# EAGLE schematic board (EAGLE 9.6.2)
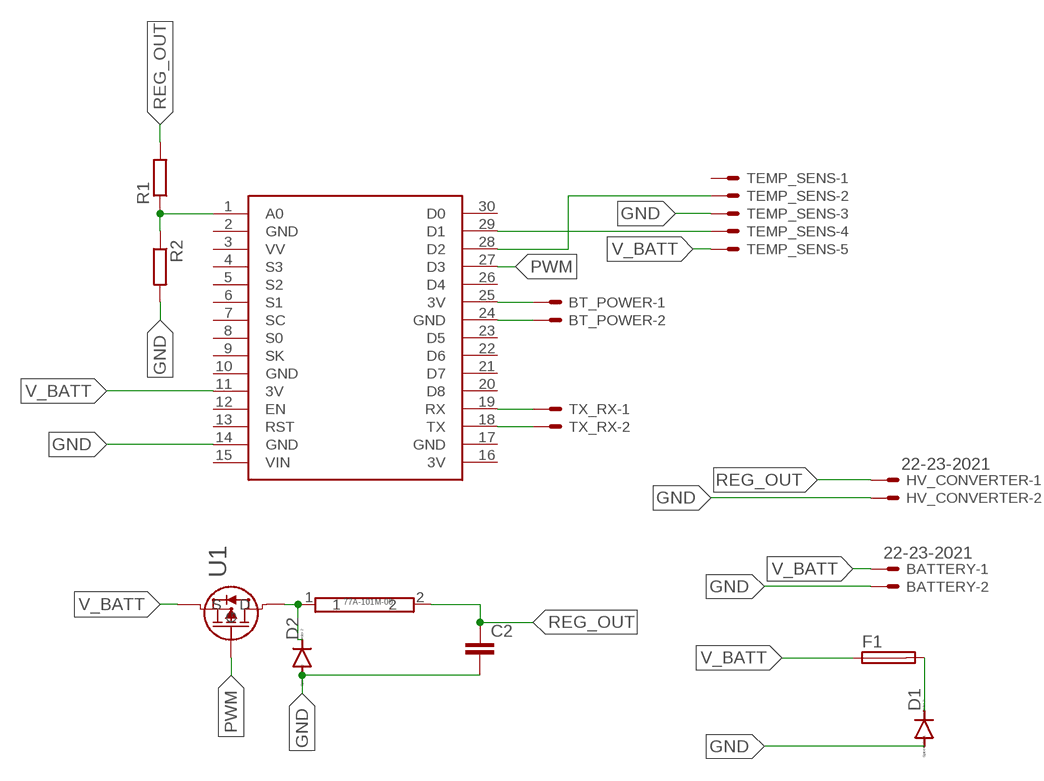
[diagram p0: schematic, sheet 1]

## Parts
BATTERY  22-23-2021  [22-23-2021]
BT_POWER  22-23-2021  [22-23-2021]
C2  C-EU025-024X044  [C025-024X044]
D1  1N4004LONGFOOTPRINT  [LONGFOOTPRINT]
D2  1N4004LONGFOOTPRINT  [LONGFOOTPRINT]
F1  GSH15  [GSH15]
HV_CONVERTER  22-23-2021  [22-23-2021]
R1  R-EU_0207/10  [0207/10]
R2  R-EU_0207/10  [0207/10]
TEMP_SENS  22-23-2051  [22-23-2051]
TX_RX  22-23-2021  [22-23-2021]
U1  IRF9510PBFIRF95110PBF  [IRF9510PBF]
U$1  NODEMCU  [NODEMCU]
U$2  77A-101M-00  [77A-101M-00]

## Nets
GND: BATTERY.2 C2.2 D1.A D2.A HV_CONVERTER.2 R2.2 TEMP_SENS.3 U$1.14(GND)
N$1: D1.C F1.2
N$2: D2.C U1.2(D) U$2.1
N$3: TX_RX.1 U$1.19(RX)
N$4: TX_RX.2 U$1.18(TX)
N$5: R1.1 R2.1 U$1.1(A0)
N$6: BT_POWER.1 U$1.25(3V)
N$7: BT_POWER.2 U$1.24(GND)
N$8: TEMP_SENS.4 U$1.29(D1)
N$9: TEMP_SENS.2 U$1.28(D2)
PWM: U1.1(G) U$1.27(D3)
REG_OUT: C2.1 HV_CONVERTER.1 R1.2 U$2.2
V_BATT: BATTERY.1 F1.1 TEMP_SENS.5 U1.3(S) U$1.11(3V)
Unconnected: TEMP_SENS.1 U$1.3(VV) U$1.4(S3) U$1.5(S2) U$1.6(S1) U$1.7(SC) U$1.8(S0) U$1.9(SK) U$1.12(EN) U$1.13(RST) U$1.15(VIN) U$1.20(D8) U$1.21(D7) U$1.22(D6) U$1.23(D5) U$1.26(D4) U$1.30(D0)

## Power pins joined to a net without a drawn wire
3V: U$1.16(3V)
GND: U$1.2(GND) U$1.10(GND) U$1.17(GND)

## Library data of the parts
BATTERY BT_POWER HV_CONVERTER TX_RX = con-molex:22-23-2021: .100" (2.54mm) Center Header - 2 Pin; MF: MOLEX; MPN: 22-23-2021; OC_FARNELL: 1462926; OC_NEWARK: 25C3832
C2 = rcl:C-EU: CAPACITOR, European symbol; SPICEPREFIX: C
D1 D2 = 1N4004longfootprint:1N4004: DIODE general purpose rectifier, 1 A
F1 = fuse:GSH15: FUSE HOLDER grid 15mm, 19649 Wickmann; MPN: 64900001039; OC_FARNELL: 1271673; OC_NEWARK: 02P0318
R1 R2 = rcl:R-EU_: RESISTOR, European symbol; SPICEPREFIX: R
TEMP_SENS = con-molex:22-23-2051: .100" (2.54mm) Center Header - 5 Pin; MF: MOLEX; MPN: 22-23-2051; OC_FARNELL: 1462952; OC_NEWARK: 38C9178
U1 = IRF9510:IRF9510PBF
U$1 = nodemcu:NODEMCU
U$2 = 77A-101M-00:77A-101M-00